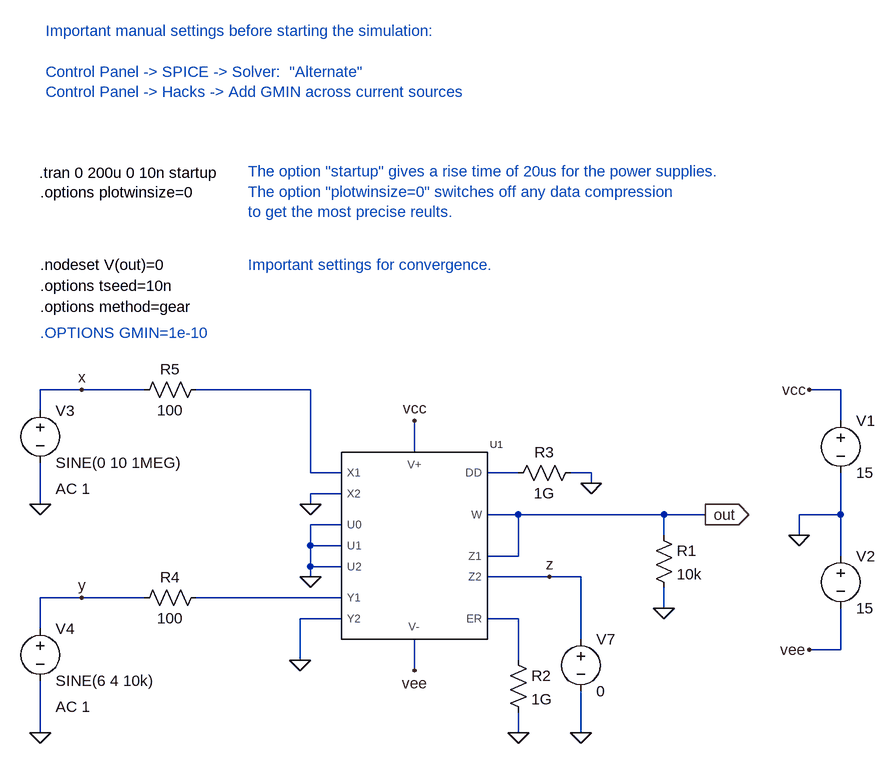
[diagram p0: schematic ad734_test.asc]
ad734_test.asc, the LTspice schematic file:
Version 4
SHEET 1 2660 1752
WIRE 96 128 96 96
WIRE 96 272 96 208
WIRE 96 464 96 416
WIRE 96 624 96 544
WIRE 160 96 96 96
WIRE 160 416 96 416
WIRE 256 96 160 96
WIRE 256 416 160 416
WIRE 496 512 496 448
WIRE 512 96 336 96
WIRE 512 224 512 96
WIRE 512 272 512 256
WIRE 512 336 512 304
WIRE 512 368 512 336
WIRE 512 384 512 368
WIRE 560 224 512 224
WIRE 560 256 512 256
WIRE 560 304 512 304
WIRE 560 336 512 336
WIRE 560 368 512 368
WIRE 560 416 336 416
WIRE 560 448 496 448
WIRE 672 192 672 144
WIRE 672 528 672 480
WIRE 832 224 784 224
WIRE 832 288 784 288
WIRE 832 352 784 352
WIRE 832 352 832 288
WIRE 832 448 784 448
WIRE 832 512 832 448
WIRE 832 624 832 592
WIRE 880 384 784 384
WIRE 928 384 880 384
WIRE 928 480 928 384
WIRE 928 624 928 560
WIRE 944 224 912 224
WIRE 944 240 944 224
WIRE 1056 288 832 288
WIRE 1056 320 1056 288
WIRE 1056 432 1056 400
WIRE 1120 288 1056 288
WIRE 1264 320 1264 288
WIRE 1328 96 1280 96
WIRE 1328 144 1328 96
WIRE 1328 288 1264 288
WIRE 1328 288 1328 224
WIRE 1328 352 1328 288
WIRE 1328 496 1280 496
WIRE 1328 496 1328 432
FLAG 1264 320 0
FLAG 96 272 0
FLAG 512 272 0
FLAG 1120 288 out
IOPIN 1120 288 Out
FLAG 96 624 0
FLAG 160 96 x
FLAG 1280 96 vcc
FLAG 1280 496 vee
FLAG 512 384 0
FLAG 496 512 0
FLAG 672 144 vcc
FLAG 672 528 vee
FLAG 160 416 y
FLAG 928 624 0
FLAG 880 384 z
FLAG 1056 432 0
FLAG 944 240 0
FLAG 832 624 0
SYMBOL voltage 1328 128 R0
WINDOW 123 0 0 Left 0
WINDOW 39 0 0 Left 0
SYMATTR InstName V1
SYMATTR Value 15
SYMBOL voltage 1328 336 R0
WINDOW 123 0 0 Left 0
WINDOW 39 0 0 Left 0
SYMATTR InstName V2
SYMATTR Value 15
SYMBOL voltage 96 112 R0
WINDOW 123 24 136 Left 0
WINDOW 39 0 0 Left 0
SYMATTR Value2 AC 1
SYMATTR InstName V3
SYMATTR Value SINE(0 10 1MEG)
SYMBOL voltage 96 448 R0
WINDOW 123 24 136 Left 0
WINDOW 39 0 0 Left 0
SYMATTR Value2 AC 1
SYMATTR InstName V4
SYMATTR Value SINE(6 4 10k)
SYMBOL voltage 928 464 R0
WINDOW 123 24 136 Left 0
WINDOW 39 0 0 Left 0
SYMATTR InstName V7
SYMATTR Value 0
SYMBOL res 1040 304 R0
SYMATTR InstName R1
SYMATTR Value 10k
SYMBOL res 816 496 R0
SYMATTR InstName R2
SYMATTR Value 1G
SYMBOL res 816 240 R270
WINDOW 0 32 56 VTop 0
WINDOW 3 0 56 VBottom 0
SYMATTR InstName R3
SYMATTR Value 1G
SYMBOL ad734 672 320 R0
SYMATTR InstName U1
SYMBOL res 240 432 R270
WINDOW 0 32 56 VTop 0
WINDOW 3 0 56 VBottom 0
SYMATTR InstName R4
SYMATTR Value 100
SYMBOL res 240 112 R270
WINDOW 0 32 56 VTop 0
WINDOW 3 0 56 VBottom 0
SYMATTR InstName R5
SYMATTR Value 100
TEXT 94 -238 Left 0 !.tran 0 200u 0 10n startup
TEXT 96 -64 Left 0 !.options tseed=10n
TEXT 96 8 Left 0 ;.OPTIONS GMIN=1e-10
TEXT 96 -208 Left 0 !.options plotwinsize=0
TEXT 416 -240 Left 0 ;The option "startup" gives a rise time of 20us for the power supplies.\nThe option "plotwinsize=0" switches off any data compression \nto get the most precise reults.
TEXT 104 -456 Left 0 ;Important manual settings before starting the simulation:\n \nControl Panel -> SPICE -> Solver:  "Alternate"\nControl Panel -> Hacks -> Add GMIN across current sources
TEXT 96 -96 Left 0 !.nodeset V(out)=0
TEXT 96 -32 Left 0 !.options method=gear
TEXT 416 -96 Left 0 ;Important settings for convergence.

The netlist it stands for:
* ad734_test.asc
V1 vcc 0 15
V2 0 vee 15
V3 x 0 SINE(0 10 1MEG) AC 1
V4 y 0 SINE(6 4 10k) AC 1
V7 z 0 0
R1 out 0 10k
R2 N004 0 1G
R3 N003 0 1G
XU1 N001 0 0 0 0 N002 0 vee N004 z out out N003 vcc AD734  ; pins X1 X2 U0 U1 U2 Y1 Y2 V- ER Z2 Z1 W DD V+
R4 y N002 100
R5 x N001 100
.tran 0 200u 0 10n startup
.options tseed=10n
* .OPTIONS GMIN=1e-10
.options plotwinsize=0
* The option "startup" gives a rise time of 20us for the power supplies.
* The option "plotwinsize=0" switches off any data compression
* to get the most precise reults.
* Important manual settings before starting the simulation:
* Control Panel -> SPICE -> Solver:  "Alternate"
* Control Panel -> Hacks -> Add GMIN across current sources
.nodeset V(out)=0
.options method=gear
* Important settings for convergence.
.lib AD734.sub
.backanno
.end